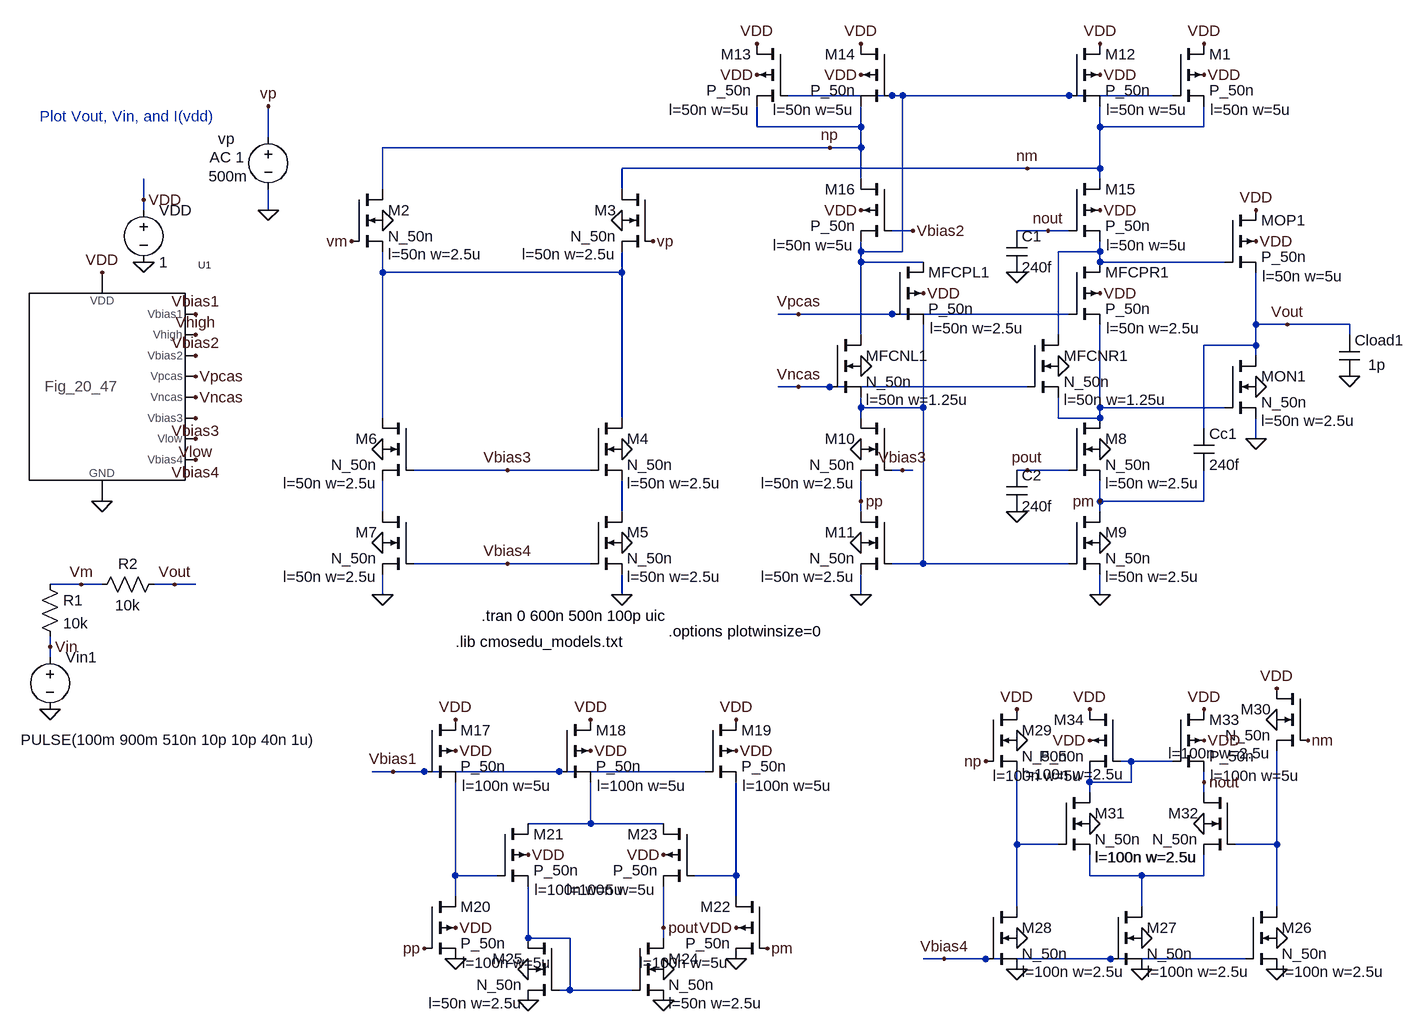
[diagram p0: schematic Fig24_53_tran.asc]
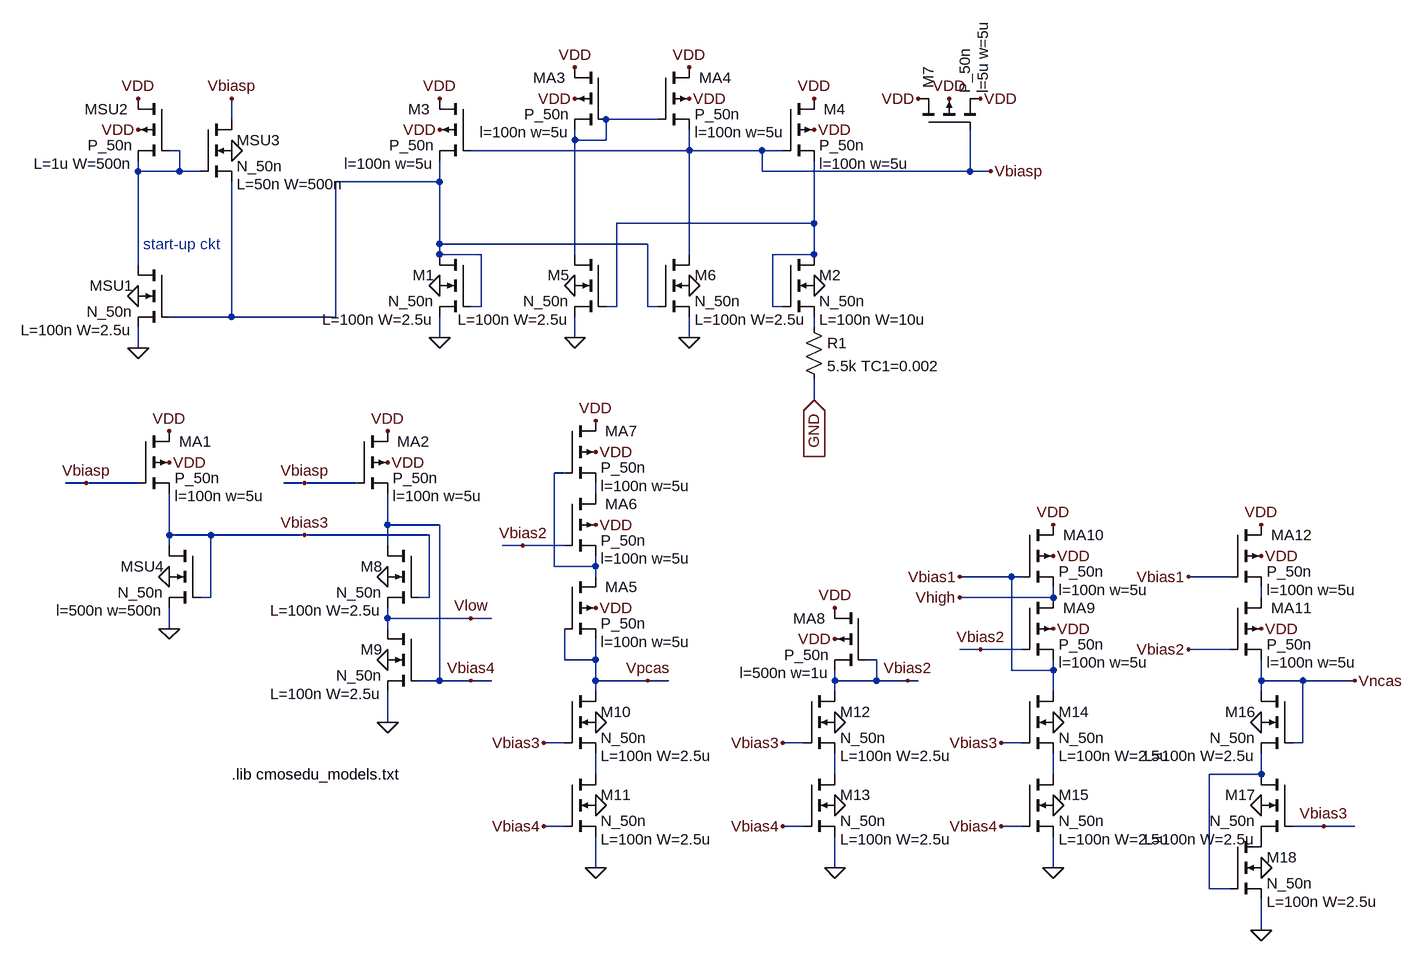
[diagram p1: sub-circuit fig_20_47.asc]
Fig24_53_tran.asc, the LTspice schematic file:
Version 4
SHEET 1 3376 680
WIRE 2512 -1136 2352 -1136
WIRE 2528 -1136 2512 -1136
WIRE 2784 -1136 2528 -1136
WIRE 2944 -1136 2784 -1136
WIRE 2304 -1088 2304 -1120
WIRE 2464 -1088 2464 -1120
WIRE 2464 -1088 2304 -1088
WIRE 2832 -1088 2832 -1120
WIRE 2992 -1088 2992 -1120
WIRE 2992 -1088 2832 -1088
WIRE 1552 -1072 1552 -1120
WIRE 2416 -1056 1728 -1056
WIRE 2464 -1056 2464 -1088
WIRE 2464 -1056 2416 -1056
WIRE 2720 -1024 2096 -1024
WIRE 2832 -1024 2832 -1088
WIRE 2832 -1024 2720 -1024
WIRE 2464 -1008 2464 -1056
WIRE 2832 -1008 2832 -1024
WIRE 1728 -992 1728 -1056
WIRE 2096 -992 2096 -1024
WIRE 1360 -976 1360 -1008
WIRE 1360 -960 1360 -976
WIRE 1552 -960 1552 -992
WIRE 2544 -928 2512 -928
WIRE 2752 -928 2704 -928
WIRE 2784 -928 2752 -928
WIRE 2464 -896 2464 -912
WIRE 2528 -896 2528 -1136
WIRE 2528 -896 2464 -896
WIRE 2832 -896 2832 -912
WIRE 2832 -896 2768 -896
WIRE 2464 -880 2464 -896
WIRE 2560 -880 2464 -880
WIRE 2832 -880 2832 -896
WIRE 3024 -880 2832 -880
WIRE 1728 -864 1728 -896
WIRE 2096 -864 2096 -896
WIRE 2096 -864 1728 -864
WIRE 2368 -800 2336 -800
WIRE 2512 -800 2368 -800
WIRE 2784 -800 2512 -800
WIRE 3072 -784 3072 -864
WIRE 3120 -784 3072 -784
WIRE 3216 -784 3120 -784
WIRE 2464 -768 2464 -880
WIRE 2768 -768 2768 -896
WIRE 3216 -768 3216 -784
WIRE 3072 -752 3072 -784
WIRE 3072 -752 2992 -752
WIRE 3072 -736 3072 -752
WIRE 2368 -688 2336 -688
WIRE 2416 -688 2368 -688
WIRE 2720 -688 2416 -688
WIRE 2464 -656 2464 -672
WIRE 2560 -656 2560 -784
WIRE 2560 -656 2464 -656
WIRE 2832 -656 2832 -784
WIRE 3024 -656 2832 -656
WIRE 1728 -640 1728 -864
WIRE 2096 -640 2096 -864
WIRE 2464 -640 2464 -656
WIRE 2768 -640 2768 -672
WIRE 2832 -640 2832 -656
WIRE 2832 -640 2768 -640
WIRE 2992 -624 2992 -752
WIRE 3072 -608 3072 -640
WIRE 1920 -560 1776 -560
WIRE 2048 -560 1920 -560
WIRE 2528 -560 2512 -560
WIRE 2544 -560 2528 -560
WIRE 2720 -560 2704 -560
WIRE 2784 -560 2720 -560
WIRE 2464 -512 2464 -544
WIRE 2832 -512 2832 -544
WIRE 2992 -512 2992 -560
WIRE 2992 -512 2832 -512
WIRE 1728 -496 1728 -544
WIRE 2096 -496 2096 -544
WIRE 2464 -496 2464 -512
WIRE 2832 -496 2832 -512
WIRE 1920 -416 1776 -416
WIRE 2048 -416 1920 -416
WIRE 2560 -416 2560 -656
WIRE 2560 -416 2512 -416
WIRE 2784 -416 2560 -416
WIRE 1264 -384 1216 -384
WIRE 1296 -384 1264 -384
WIRE 1408 -384 1376 -384
WIRE 1440 -384 1408 -384
WIRE 1728 -368 1728 -400
WIRE 2096 -368 2096 -400
WIRE 2464 -368 2464 -400
WIRE 2832 -368 2832 -400
WIRE 1216 -288 1216 -304
WIRE 1216 -272 1216 -288
WIRE 2880 -112 2864 -112
WIRE 2944 -112 2880 -112
WIRE 1744 -96 1712 -96
WIRE 1792 -96 1744 -96
WIRE 2000 -96 1792 -96
WIRE 2224 -96 2000 -96
WIRE 2816 -80 2816 -96
WIRE 2880 -80 2880 -112
WIRE 2880 -80 2816 -80
WIRE 2992 -80 2992 -96
WIRE 2816 -64 2816 -80
WIRE 2992 -64 2992 -80
WIRE 2048 -16 2048 -80
WIRE 2048 -16 1952 -16
WIRE 2160 -16 2048 -16
WIRE 2704 16 2704 -96
WIRE 2768 16 2704 16
WIRE 3104 16 3104 -128
WIRE 3104 16 3040 16
WIRE 1840 64 1840 -80
WIRE 1904 64 1840 64
WIRE 2272 64 2272 -80
WIRE 2272 64 2208 64
WIRE 2816 64 2816 32
WIRE 2896 64 2816 64
WIRE 2992 64 2992 32
WIRE 2992 64 2896 64
WIRE 1840 96 1840 64
WIRE 2272 96 2272 64
WIRE 2704 112 2704 16
WIRE 2896 112 2896 64
WIRE 3104 112 3104 16
WIRE 2160 144 2160 80
WIRE 1952 160 1952 80
WIRE 2016 160 1952 160
WIRE 2160 160 2160 144
WIRE 2592 192 2560 192
WIRE 2656 192 2592 192
WIRE 2848 192 2656 192
WIRE 3056 192 2848 192
WIRE 2016 240 2016 160
WIRE 2016 240 2000 240
WIRE 2112 240 2016 240
FLAG 1360 -880 0
FLAG 1360 -976 VDD
FLAG 1296 -864 VDD
FLAG 1296 -512 0
FLAG 1440 -800 Vbias1
FLAG 1440 -768 Vhigh
FLAG 1440 -736 Vbias2
FLAG 1440 -640 Vbias3
FLAG 1440 -704 Vpcas
FLAG 1440 -672 Vncas
FLAG 1440 -576 Vbias4
FLAG 1440 -608 Vlow
FLAG 1552 -960 0
FLAG 1552 -1120 vp
FLAG 1216 -192 0
FLAG 1408 -384 Vout
FLAG 1264 -384 Vm
FLAG 1216 -288 Vin
FLAG 1840 -128 VDD
FLAG 1840 -176 VDD
FLAG 2048 -128 VDD
FLAG 2048 -176 VDD
FLAG 2272 -128 VDD
FLAG 2272 -176 VDD
FLAG 1744 -96 Vbias1
FLAG 1840 144 VDD
FLAG 1952 32 VDD
FLAG 2272 144 VDD
FLAG 2160 32 VDD
FLAG 2160 208 0
FLAG 1952 208 0
FLAG 1952 256 0
FLAG 2160 256 0
FLAG 2272 192 0
FLAG 1840 192 0
FLAG 1792 176 pp
FLAG 2320 176 pm
FLAG 2160 144 pout
FLAG 3104 160 0
FLAG 3104 208 0
FLAG 2896 160 0
FLAG 2896 208 0
FLAG 2704 160 0
FLAG 2704 208 0
FLAG 2592 192 Vbias4
FLAG 2704 -144 0
FLAG 3104 -176 0
FLAG 2704 -192 VDD
FLAG 3104 -224 VDD
FLAG 2656 -112 np
FLAG 3152 -144 nm
FLAG 2816 -16 0
FLAG 2992 -16 0
FLAG 2992 -144 VDD
FLAG 2992 -192 VDD
FLAG 2816 -144 VDD
FLAG 2816 -192 VDD
FLAG 2992 -80 nout
FLAG 2992 -1168 VDD
FLAG 1728 -944 0
FLAG 2096 -944 0
FLAG 1680 -912 vm
FLAG 2144 -912 vp
FLAG 2096 -592 0
FLAG 2096 -448 0
FLAG 2096 -368 0
FLAG 1728 -592 0
FLAG 1728 -448 0
FLAG 1728 -368 0
FLAG 1920 -560 Vbias3
FLAG 1920 -416 Vbias4
FLAG 2832 -592 0
FLAG 2832 -448 0
FLAG 2832 -368 0
FLAG 2464 -592 0
FLAG 2464 -448 0
FLAG 2464 -368 0
FLAG 2528 -560 Vbias3
FLAG 2832 -1168 VDD
FLAG 2832 -1216 VDD
FLAG 2992 -1216 VDD
FLAG 2304 -1168 VDD
FLAG 2464 -1168 VDD
FLAG 2464 -1216 VDD
FLAG 2304 -1216 VDD
FLAG 2832 -960 VDD
FLAG 2464 -960 VDD
FLAG 2544 -928 Vbias2
FLAG 3216 -704 0
FLAG 3120 -784 Vout
FLAG 2560 -832 VDD
FLAG 2832 -832 VDD
FLAG 2768 -720 0
FLAG 2464 -720 0
FLAG 2368 -800 Vpcas
FLAG 2368 -688 Vncas
FLAG 3072 -912 VDD
FLAG 3072 -960 VDD
FLAG 3072 -688 0
FLAG 3072 -608 0
FLAG 2752 -928 nout
FLAG 2720 -1024 nm
FLAG 2416 -1056 np
FLAG 2720 -560 pout
FLAG 2832 -512 pm
FLAG 2464 -512 pp
FLAG 2704 -864 0
FLAG 2704 -496 0
SYMBOL voltage 1360 -976 R0
WINDOW 123 0 0 Left 0
WINDOW 39 0 0 Left 0
SYMATTR InstName VDD
SYMATTR Value 1
SYMBOL Fig_20_47 1296 -688 R0
SYMATTR InstName U1
SYMBOL voltage 1552 -1088 R0
WINDOW 0 -77 18 Left 0
WINDOW 3 -92 76 Left 0
WINDOW 123 -90 47 Left 0
WINDOW 39 0 0 Left 0
SYMATTR InstName vp
SYMATTR Value 500m
SYMATTR Value2 AC 1
SYMBOL voltage 1216 -288 R0
WINDOW 3 -45 143 Left 0
WINDOW 123 0 0 Left 0
WINDOW 39 0 0 Left 0
SYMATTR Value PULSE(100m 900m 510n 10p 10p 40n 1u)
SYMATTR InstName Vin1
SYMBOL res 1200 -400 R0
SYMATTR InstName R1
SYMATTR Value 10k
SYMBOL res 1280 -368 R270
WINDOW 0 32 56 VTop 0
WINDOW 3 0 56 VBottom 0
SYMATTR InstName R2
SYMATTR Value 10k
SYMBOL pmos4 1792 -176 R0
WINDOW 123 58 102 Left 0
WINDOW 0 56 16 Left 0
SYMATTR Value2 l=100n w=5u
SYMATTR InstName M17
SYMATTR Value P_50n
SYMBOL pmos4 2000 -176 R0
WINDOW 123 58 102 Left 0
WINDOW 0 56 16 Left 0
SYMATTR Value2 l=100n w=5u
SYMATTR InstName M18
SYMATTR Value P_50n
SYMBOL pmos4 2224 -176 R0
WINDOW 123 58 102 Left 0
WINDOW 0 56 16 Left 0
SYMATTR Value2 l=100n w=5u
SYMATTR InstName M19
SYMATTR Value P_50n
SYMBOL pmos4 1792 96 R0
WINDOW 123 58 102 Left 0
WINDOW 0 56 16 Left 0
SYMATTR Value2 l=100n w=5u
SYMATTR InstName M20
SYMATTR Value P_50n
SYMBOL pmos4 1904 -16 R0
WINDOW 123 58 102 Left 0
WINDOW 0 56 16 Left 0
SYMATTR Value2 l=100n w=5u
SYMATTR InstName M21
SYMATTR Value P_50n
SYMBOL pmos4 2320 96 M0
WINDOW 123 58 102 Left 0
WINDOW 0 56 16 Left 0
SYMATTR Value2 l=100n w=5u
SYMATTR InstName M22
SYMATTR Value P_50n
SYMBOL pmos4 2208 -16 M0
WINDOW 123 58 102 Left 0
WINDOW 0 56 16 Left 0
SYMATTR Value2 l=100n w=5u
SYMATTR InstName M23
SYMATTR Value P_50n
SYMBOL nmos4 2112 160 R0
WINDOW 123 56 100 Left 0
SYMATTR Value2 l=50n w=2.5u
SYMATTR InstName M24
SYMATTR Value N_50n
SYMBOL nmos4 2000 160 M0
WINDOW 123 56 100 Left 0
SYMATTR Value2 l=50n w=2.5u
SYMATTR InstName M25
SYMATTR Value N_50n
SYMBOL nmos4 3056 112 R0
WINDOW 123 56 100 Left 0
SYMATTR Value2 l=100n w=2.5u
SYMATTR InstName M26
SYMATTR Value N_50n
SYMBOL nmos4 2848 112 R0
WINDOW 123 56 100 Left 0
SYMATTR Value2 l=100n w=2.5u
SYMATTR InstName M27
SYMATTR Value N_50n
SYMBOL nmos4 2656 112 R0
WINDOW 123 56 100 Left 0
SYMATTR Value2 l=100n w=2.5u
SYMATTR InstName M28
SYMATTR Value N_50n
SYMBOL nmos4 2656 -192 R0
WINDOW 123 56 100 Left 0
SYMATTR Value2 l=100n w=2.5u
SYMATTR InstName M29
SYMATTR Value N_50n
SYMBOL nmos4 3152 -224 M0
WINDOW 123 56 100 Left 0
SYMATTR Value2 l=100n w=2.5u
SYMATTR InstName M30
SYMATTR Value N_50n
SYMBOL nmos4 2768 -64 R0
WINDOW 123 56 100 Left 0
SYMATTR Value2 l=100n w=2.5u
SYMATTR InstName M31
SYMATTR Value N_50n
SYMBOL nmos4 3040 -64 M0
WINDOW 123 56 100 Left 0
SYMATTR Value2 l=100n w=2.5u
SYMATTR InstName M32
SYMATTR Value N_50n
SYMBOL pmos4 2944 -192 R0
WINDOW 123 58 102 Left 0
WINDOW 0 56 16 Left 0
SYMATTR Value2 l=100n w=5u
SYMATTR InstName M33
SYMATTR Value P_50n
SYMBOL pmos4 2864 -192 M0
WINDOW 123 58 102 Left 0
WINDOW 0 56 16 Left 0
SYMATTR Value2 l=100n w=5u
SYMATTR InstName M34
SYMATTR Value P_50n
SYMBOL pmos4 2944 -1216 R0
WINDOW 123 58 102 Left 0
WINDOW 0 56 16 Left 0
SYMATTR Value2 l=50n w=5u
SYMATTR InstName M1
SYMATTR Value P_50n
SYMBOL nmos4 1680 -992 R0
WINDOW 123 56 100 Left 0
SYMATTR Value2 l=50n w=2.5u
SYMATTR InstName M2
SYMATTR Value N_50n
SYMBOL nmos4 2144 -992 M0
WINDOW 123 56 100 Left 0
SYMATTR Value2 l=50n w=2.5u
SYMATTR InstName M3
SYMATTR Value N_50n
SYMBOL nmos4 2048 -640 R0
WINDOW 123 56 100 Left 0
SYMATTR Value2 l=50n w=2.5u
SYMATTR InstName M4
SYMATTR Value N_50n
SYMBOL nmos4 2048 -496 R0
WINDOW 123 56 100 Left 0
SYMATTR Value2 l=50n w=2.5u
SYMATTR InstName M5
SYMATTR Value N_50n
SYMBOL nmos4 1776 -640 M0
WINDOW 123 56 100 Left 0
SYMATTR Value2 l=50n w=2.5u
SYMATTR InstName M6
SYMATTR Value N_50n
SYMBOL nmos4 1776 -496 M0
WINDOW 123 56 100 Left 0
SYMATTR Value2 l=50n w=2.5u
SYMATTR InstName M7
SYMATTR Value N_50n
SYMBOL nmos4 2784 -640 R0
WINDOW 123 56 100 Left 0
SYMATTR Value2 l=50n w=2.5u
SYMATTR InstName M8
SYMATTR Value N_50n
SYMBOL nmos4 2784 -496 R0
WINDOW 123 56 100 Left 0
SYMATTR Value2 l=50n w=2.5u
SYMATTR InstName M9
SYMATTR Value N_50n
SYMBOL nmos4 2512 -640 M0
WINDOW 123 56 100 Left 0
SYMATTR Value2 l=50n w=2.5u
SYMATTR InstName M10
SYMATTR Value N_50n
SYMBOL nmos4 2512 -496 M0
WINDOW 123 56 100 Left 0
SYMATTR Value2 l=50n w=2.5u
SYMATTR InstName M11
SYMATTR Value N_50n
SYMBOL pmos4 2784 -1216 R0
WINDOW 123 58 102 Left 0
WINDOW 0 56 16 Left 0
SYMATTR Value2 l=50n w=5u
SYMATTR InstName M12
SYMATTR Value P_50n
SYMBOL pmos4 2352 -1216 M0
WINDOW 123 58 102 Left 0
WINDOW 0 56 16 Left 0
SYMATTR Value2 l=50n w=5u
SYMATTR InstName M13
SYMATTR Value P_50n
SYMBOL pmos4 2512 -1216 M0
WINDOW 123 58 102 Left 0
WINDOW 0 56 16 Left 0
SYMATTR Value2 l=50n w=5u
SYMATTR InstName M14
SYMATTR Value P_50n
SYMBOL pmos4 2784 -1008 R0
WINDOW 123 58 102 Left 0
WINDOW 0 56 16 Left 0
SYMATTR Value2 l=50n w=5u
SYMATTR InstName M15
SYMATTR Value P_50n
SYMBOL pmos4 2512 -1008 M0
WINDOW 123 58 102 Left 0
WINDOW 0 56 16 Left 0
SYMATTR Value2 l=50n w=5u
SYMATTR InstName M16
SYMATTR Value P_50n
SYMBOL cap 3200 -768 R0
WINDOW 3 45 46 Left 0
SYMATTR Value 1p
SYMATTR InstName Cload1
SYMBOL pmos4 2512 -880 R0
WINDOW 123 58 102 Left 0
WINDOW 0 56 16 Left 0
SYMATTR Value2 l=50n w=2.5u
SYMATTR InstName MFCPL1
SYMATTR Value P_50n
SYMBOL pmos4 2784 -880 R0
WINDOW 123 58 102 Left 0
WINDOW 0 56 16 Left 0
SYMATTR Value2 l=50n w=2.5u
SYMATTR InstName MFCPR1
SYMATTR Value P_50n
SYMBOL nmos4 2720 -768 R0
WINDOW 123 56 100 Left 0
SYMATTR Value2 l=50n w=1.25u
SYMATTR InstName MFCNR1
SYMATTR Value N_50n
SYMBOL nmos4 2416 -768 R0
WINDOW 123 56 100 Left 0
SYMATTR Value2 l=50n w=1.25u
SYMATTR InstName MFCNL1
SYMATTR Value N_50n
SYMBOL pmos4 3024 -960 R0
WINDOW 123 58 102 Left 0
WINDOW 0 56 16 Left 0
SYMATTR Value2 l=50n w=5u
SYMATTR InstName MOP1
SYMATTR Value P_50n
SYMBOL nmos4 3024 -736 R0
WINDOW 123 56 100 Left 0
SYMATTR Value2 l=50n w=2.5u
SYMATTR InstName MON1
SYMATTR Value N_50n
SYMBOL cap 2976 -624 R0
SYMATTR InstName Cc1
SYMATTR Value 240f
SYMBOL cap 2688 -928 R0
SYMATTR InstName C1
SYMATTR Value 240f
SYMBOL cap 2688 -560 R0
SYMATTR InstName C2
SYMATTR Value 240f
TEXT 1840 -296 Left 0 !.lib cmosedu_models.txt
TEXT 1880 -336 Left 0 !.tran 0 600n 500n 100p uic
TEXT 1200 -1104 Left 0 ;Plot Vout, Vin, and I(vdd)
TEXT 2168 -312 Left 0 !.options plotwinsize=0

fig_20_47.asc, the sub-circuit schematic file:
Version 4
SHEET 1 2508 1124
WIRE 464 416 432 416
WIRE 544 -64 544 -80
WIRE 544 80 544 -64
WIRE 544 208 544 176
WIRE 544 416 464 416
WIRE 592 496 592 432
WIRE 592 512 592 496
WIRE 592 640 592 608
WIRE 608 -96 592 -96
WIRE 608 -64 544 -64
WIRE 608 -64 608 -96
WIRE 640 -64 608 -64
WIRE 656 496 592 496
WIRE 656 592 640 592
WIRE 656 592 656 496
WIRE 688 -144 688 -176
WIRE 688 160 592 160
WIRE 688 160 688 -48
WIRE 800 416 768 416
WIRE 800 496 656 496
WIRE 848 160 688 160
WIRE 848 160 848 -48
WIRE 880 416 800 416
WIRE 928 480 928 432
WIRE 928 512 928 480
WIRE 928 624 928 608
WIRE 928 640 928 624
WIRE 928 784 928 736
WIRE 992 496 800 496
WIRE 992 592 976 592
WIRE 992 592 992 496
WIRE 1008 -48 848 -48
WIRE 1008 -48 1008 -80
WIRE 1008 48 1008 -48
WIRE 1008 64 1008 48
WIRE 1008 192 1008 160
WIRE 1008 480 928 480
WIRE 1008 720 976 720
WIRE 1008 720 1008 480
WIRE 1056 624 928 624
WIRE 1056 720 1008 720
WIRE 1072 64 1008 64
WIRE 1072 144 1056 144
WIRE 1072 144 1072 64
WIRE 1088 624 1056 624
WIRE 1088 720 1056 720
WIRE 1136 512 1104 512
WIRE 1184 544 1184 400
WIRE 1200 400 1184 400
WIRE 1200 512 1136 512
WIRE 1200 688 1200 640
WIRE 1200 816 1168 816
WIRE 1200 944 1168 944
WIRE 1216 -112 1216 -128
WIRE 1216 64 1216 -112
WIRE 1216 192 1216 160
WIRE 1248 432 1248 416
WIRE 1248 544 1184 544
WIRE 1248 544 1248 528
WIRE 1248 560 1248 544
WIRE 1248 688 1200 688
WIRE 1248 688 1248 656
WIRE 1248 720 1248 688
WIRE 1248 736 1248 720
WIRE 1248 864 1248 832
WIRE 1248 1008 1248 960
WIRE 1264 -112 1216 -112
WIRE 1264 -112 1264 -144
WIRE 1280 144 1264 144
WIRE 1280 144 1280 16
WIRE 1328 48 1008 48
WIRE 1328 144 1328 48
WIRE 1328 720 1248 720
WIRE 1344 -144 1264 -144
WIRE 1344 144 1328 144
WIRE 1360 720 1328 720
WIRE 1392 -96 1056 -96
WIRE 1392 -96 1392 -128
WIRE 1392 64 1392 -96
WIRE 1392 192 1392 160
WIRE 1504 -96 1392 -96
WIRE 1504 -64 1504 -96
WIRE 1520 144 1520 64
WIRE 1536 -96 1504 -96
WIRE 1536 144 1520 144
WIRE 1568 816 1536 816
WIRE 1568 944 1536 944
WIRE 1584 16 1280 16
WIRE 1584 16 1584 -80
WIRE 1584 64 1520 64
WIRE 1584 64 1584 16
WIRE 1584 176 1584 160
WIRE 1584 288 1584 256
WIRE 1616 720 1616 704
WIRE 1616 736 1616 720
WIRE 1616 864 1616 832
WIRE 1616 1008 1616 960
WIRE 1680 688 1664 688
WIRE 1680 720 1616 720
WIRE 1680 720 1680 688
WIRE 1728 720 1680 720
WIRE 1744 720 1728 720
WIRE 1824 -64 1504 -64
WIRE 1824 -64 1824 -128
WIRE 1840 672 1808 672
WIRE 1856 -64 1824 -64
WIRE 1888 560 1808 560
WIRE 1888 704 1888 560
WIRE 1904 560 1888 560
WIRE 1904 672 1840 672
WIRE 1904 816 1872 816
WIRE 1904 944 1872 944
WIRE 1952 592 1808 592
WIRE 1952 592 1952 576
WIRE 1952 704 1888 704
WIRE 1952 704 1952 688
WIRE 1952 736 1952 704
WIRE 1952 864 1952 832
WIRE 1952 1008 1952 960
WIRE 2192 1040 2192 864
WIRE 2224 560 2160 560
WIRE 2224 672 2160 672
WIRE 2224 1040 2192 1040
WIRE 2272 592 2272 576
WIRE 2272 720 2272 688
WIRE 2272 736 2272 720
WIRE 2272 864 2192 864
WIRE 2272 864 2272 832
WIRE 2272 880 2272 864
WIRE 2272 1104 2272 1056
WIRE 2336 720 2272 720
WIRE 2336 816 2320 816
WIRE 2336 816 2336 720
WIRE 2368 944 2320 944
WIRE 2416 720 2336 720
WIRE 2416 944 2368 944
FLAG 544 -128 VDD
FLAG 544 -176 VDD
FLAG 544 208 0
FLAG 544 128 0
FLAG 688 -96 0
FLAG 688 -176 Vbiasp
FLAG 1008 -128 VDD
FLAG 1008 -176 VDD
FLAG 1584 -128 VDD
FLAG 1584 -176 VDD
FLAG 1856 -64 Vbiasp
FLAG 1008 192 0
FLAG 1008 112 0
FLAG 1584 112 0
FLAG 1392 -176 VDD
FLAG 1392 -224 VDD
FLAG 1216 -176 VDD
FLAG 1216 -224 VDD
FLAG 1216 112 0
FLAG 1392 112 0
FLAG 1216 192 0
FLAG 1392 192 0
FLAG 1792 -176 VDD
FLAG 1744 -176 VDD
FLAG 1840 -176 VDD
FLAG 592 384 VDD
FLAG 592 336 VDD
FLAG 464 416 Vbiasp
FLAG 928 384 VDD
FLAG 928 336 VDD
FLAG 800 416 Vbiasp
FLAG 592 640 0
FLAG 592 560 0
FLAG 928 560 0
FLAG 928 688 0
FLAG 928 784 0
FLAG 800 496 Vbias3
FLAG 1248 784 0
FLAG 1248 912 0
FLAG 1248 1008 0
FLAG 1056 624 Vlow
FLAG 1056 720 Vbias4
FLAG 1168 816 Vbias3
FLAG 1168 944 Vbias4
FLAG 1616 784 0
FLAG 1616 912 0
FLAG 1616 1008 0
FLAG 1536 816 Vbias3
FLAG 1536 944 Vbias4
FLAG 1952 784 0
FLAG 1952 912 0
FLAG 1952 1008 0
FLAG 1872 816 Vbias3
FLAG 1872 944 Vbias4
FLAG 1248 608 VDD
FLAG 1328 720 Vpcas
FLAG 1248 480 VDD
FLAG 1248 368 VDD
FLAG 1248 320 VDD
FLAG 1136 512 Vbias2
FLAG 1616 656 VDD
FLAG 1616 608 VDD
FLAG 1728 720 Vbias2
FLAG 1952 640 VDD
FLAG 1952 528 VDD
FLAG 1952 480 VDD
FLAG 1840 672 Vbias2
FLAG 1808 560 Vbias1
FLAG 1808 592 Vhigh
FLAG 2272 640 VDD
FLAG 2272 528 VDD
FLAG 2272 480 VDD
FLAG 2160 560 Vbias1
FLAG 2160 672 Vbias2
FLAG 2272 784 0
FLAG 2272 912 0
FLAG 2272 1008 0
FLAG 2272 1104 0
FLAG 2416 720 Vncas
FLAG 2368 944 Vbias3
FLAG 1584 288 GND
IOPIN 1584 288 In
SYMBOL pmos4 592 -176 M0
WINDOW 0 63 16 Left 0
WINDOW 123 56 100 Left 0
SYMATTR InstName MSU2
SYMATTR Value2 L=1u W=500n
SYMATTR Value P_50n
SYMBOL nmos4 592 80 M0
WINDOW 123 56 100 Left 0
SYMATTR Value2 L=100n W=2.5u
SYMATTR InstName MSU1
SYMATTR Value N_50n
SYMBOL nmos4 640 -144 R0
WINDOW 123 56 100 Left 0
SYMATTR Value2 L=50n W=500n
SYMATTR InstName MSU3
SYMATTR Value N_50n
SYMBOL pmos4 1056 -176 M0
WINDOW 0 63 16 Left 0
WINDOW 123 56 100 Left 0
SYMATTR InstName M3
SYMATTR Value2 l=100n w=5u
SYMATTR Value P_50n
SYMBOL pmos4 1536 -176 R0
WINDOW 0 63 16 Left 0
WINDOW 123 56 100 Left 0
SYMATTR InstName M4
SYMATTR Value2 l=100n w=5u
SYMATTR Value P_50n
SYMBOL nmos4 1056 64 M0
WINDOW 123 56 100 Left 0
SYMATTR Value2 L=100n W=2.5u
SYMATTR InstName M1
SYMATTR Value N_50n
SYMBOL nmos4 1536 64 R0
WINDOW 123 56 100 Left 0
SYMATTR Value2 L=100n W=10u
SYMATTR InstName M2
SYMATTR Value N_50n
SYMBOL res 1568 160 R0
SYMATTR InstName R1
SYMATTR Value 5.5k TC1=0.002
SYMBOL pmos4 1344 -224 R0
WINDOW 0 63 16 Left 0
WINDOW 123 56 100 Left 0
SYMATTR InstName MA4
SYMATTR Value2 l=100n w=5u
SYMATTR Value P_50n
SYMBOL pmos4 1264 -224 M0
WINDOW 0 63 16 Left 0
WINDOW 123 56 100 Left 0
SYMATTR InstName MA3
SYMATTR Value2 l=100n w=5u
SYMATTR Value P_50n
SYMBOL nmos4 1264 64 M0
WINDOW 123 56 100 Left 0
SYMATTR Value2 L=100n W=2.5u
SYMATTR InstName M5
SYMATTR Value N_50n
SYMBOL nmos4 1344 64 R0
WINDOW 123 56 100 Left 0
SYMATTR Value2 L=100n W=2.5u
SYMATTR InstName M6
SYMATTR Value N_50n
SYMBOL pmos4 1744 -128 R270
WINDOW 0 63 16 Left 0
WINDOW 123 56 100 Left 0
SYMATTR InstName M7
SYMATTR Value2 l=5u w=5u
SYMATTR Value P_50n
SYMBOL pmos4 544 336 R0
WINDOW 0 63 16 Left 0
WINDOW 123 56 100 Left 0
SYMATTR InstName MA1
SYMATTR Value2 l=100n w=5u
SYMATTR Value P_50n
SYMBOL pmos4 880 336 R0
WINDOW 0 63 16 Left 0
WINDOW 123 56 100 Left 0
SYMATTR InstName MA2
SYMATTR Value2 l=100n w=5u
SYMATTR Value P_50n
SYMBOL nmos4 640 512 M0
WINDOW 123 56 100 Left 0
SYMATTR Value2 l=500n w=500n
SYMATTR InstName MSU4
SYMATTR Value N_50n
SYMBOL nmos4 976 512 M0
WINDOW 123 56 100 Left 0
SYMATTR Value2 L=100n W=2.5u
SYMATTR InstName M8
SYMATTR Value N_50n
SYMBOL nmos4 976 640 M0
WINDOW 123 56 100 Left 0
SYMATTR Value2 L=100n W=2.5u
SYMATTR InstName M9
SYMATTR Value N_50n
SYMBOL nmos4 1200 736 R0
WINDOW 123 56 100 Left 0
SYMATTR Value2 L=100n W=2.5u
SYMATTR InstName M10
SYMATTR Value N_50n
SYMBOL nmos4 1200 864 R0
WINDOW 123 56 100 Left 0
SYMATTR Value2 L=100n W=2.5u
SYMATTR InstName M11
SYMATTR Value N_50n
SYMBOL nmos4 1568 736 R0
WINDOW 123 56 100 Left 0
SYMATTR Value2 L=100n W=2.5u
SYMATTR InstName M12
SYMATTR Value N_50n
SYMBOL nmos4 1568 864 R0
WINDOW 123 56 100 Left 0
SYMATTR Value2 L=100n W=2.5u
SYMATTR InstName M13
SYMATTR Value N_50n
SYMBOL nmos4 1904 736 R0
WINDOW 123 56 100 Left 0
SYMATTR Value2 L=100n W=2.5u
SYMATTR InstName M14
SYMATTR Value N_50n
SYMBOL nmos4 1904 864 R0
WINDOW 123 56 100 Left 0
SYMATTR Value2 L=100n W=2.5u
SYMATTR InstName M15
SYMATTR Value N_50n
SYMBOL pmos4 1200 560 R0
WINDOW 0 63 16 Left 0
WINDOW 123 56 100 Left 0
SYMATTR InstName MA5
SYMATTR Value2 l=100n w=5u
SYMATTR Value P_50n
SYMBOL pmos4 1200 432 R0
WINDOW 0 63 16 Left 0
WINDOW 123 56 100 Left 0
SYMATTR InstName MA6
SYMATTR Value2 l=100n w=5u
SYMATTR Value P_50n
SYMBOL pmos4 1200 320 R0
WINDOW 0 63 16 Left 0
WINDOW 123 56 100 Left 0
SYMATTR InstName MA7
SYMATTR Value2 l=100n w=5u
SYMATTR Value P_50n
SYMBOL pmos4 1664 608 M0
WINDOW 0 63 16 Left 0
WINDOW 123 56 100 Left 0
SYMATTR InstName MA8
SYMATTR Value2 l=500n w=1u
SYMATTR Value P_50n
SYMBOL pmos4 1904 592 R0
WINDOW 0 63 16 Left 0
WINDOW 123 56 100 Left 0
SYMATTR InstName MA9
SYMATTR Value2 l=100n w=5u
SYMATTR Value P_50n
SYMBOL pmos4 1904 480 R0
WINDOW 0 63 16 Left 0
WINDOW 123 56 100 Left 0
SYMATTR InstName MA10
SYMATTR Value2 l=100n w=5u
SYMATTR Value P_50n
SYMBOL pmos4 2224 592 R0
WINDOW 0 63 16 Left 0
WINDOW 123 56 100 Left 0
SYMATTR InstName MA11
SYMATTR Value2 l=100n w=5u
SYMATTR Value P_50n
SYMBOL pmos4 2224 480 R0
WINDOW 0 63 16 Left 0
WINDOW 123 56 100 Left 0
SYMATTR InstName MA12
SYMATTR Value2 l=100n w=5u
SYMATTR Value P_50n
SYMBOL nmos4 2320 736 M0
WINDOW 123 56 100 Left 0
SYMATTR Value2 L=100n W=2.5u
SYMATTR InstName M16
SYMATTR Value N_50n
SYMBOL nmos4 2320 864 M0
WINDOW 123 56 100 Left 0
SYMATTR Value2 L=100n W=2.5u
SYMATTR InstName M17
SYMATTR Value N_50n
SYMBOL nmos4 2224 960 R0
WINDOW 123 56 100 Left 0
SYMATTR Value2 L=100n W=2.5u
SYMATTR InstName M18
SYMATTR Value N_50n
TEXT 552 48 Left 0 ;start-up ckt
TEXT 688 864 Left 0 !.lib cmosedu_models.txt

The netlist it stands for:
* Fig24_53_tran.asc
VDD VDD 0 1
XU1 Vbias1 Vhigh Vbias2 Vpcas Vncas Vbias3 Vlow Vbias4 VDD 0 fig_20_47
vp vp 0 500m AC 1
Vin1 Vin 0 PULSE(100m 900m 510n 10p 10p 40n 1u)
R1 Vm Vin 10k
R2 Vm Vout 10k
M17 VDD Vbias1 N012 VDD P_50n l=100n w=5u
M18 VDD Vbias1 N009 VDD P_50n l=100n w=5u
M19 VDD Vbias1 N013 VDD P_50n l=100n w=5u
M20 N012 pp 0 VDD P_50n l=100n w=5u
M21 N009 N012 N015 VDD P_50n l=100n w=5u
M22 N013 pm 0 VDD P_50n l=100n w=5u
M23 N009 N013 pout VDD P_50n l=100n w=5u
M24 pout N015 0 0 N_50n l=50n w=2.5u
M25 N015 N015 0 0 N_50n l=50n w=2.5u
M26 N011 Vbias4 0 0 N_50n l=100n w=2.5u
M27 N014 Vbias4 0 0 N_50n l=100n w=2.5u
M28 N010 Vbias4 0 0 N_50n l=100n w=2.5u
M29 VDD np N010 0 N_50n l=100n w=2.5u
M30 VDD nm N011 0 N_50n l=100n w=2.5u
M31 N008 N010 N014 0 N_50n l=100n w=2.5u
M32 nout N011 N014 0 N_50n l=100n w=2.5u
M33 VDD N008 nout VDD P_50n l=100n w=5u
M34 VDD N008 N008 VDD P_50n l=100n w=5u
M1 VDD N001 nm VDD P_50n l=50n w=5u
M2 np Vm N003 0 N_50n l=50n w=2.5u
M3 nm vp N003 0 N_50n l=50n w=2.5u
M4 N003 Vbias3 N007 0 N_50n l=50n w=2.5u
M5 N007 Vbias4 0 0 N_50n l=50n w=2.5u
M6 N003 Vbias3 N006 0 N_50n l=50n w=2.5u
M7 N006 Vbias4 0 0 N_50n l=50n w=2.5u
M8 N005 pout pm 0 N_50n l=50n w=2.5u
M9 pm N004 0 0 N_50n l=50n w=2.5u
M10 N004 Vbias3 pp 0 N_50n l=50n w=2.5u
M11 pp N004 0 0 N_50n l=50n w=2.5u
M12 VDD N001 nm VDD P_50n l=50n w=5u
M13 VDD N001 np VDD P_50n l=50n w=5u
M14 VDD N001 np VDD P_50n l=50n w=5u
M15 nm nout N002 VDD P_50n l=50n w=5u
M16 np Vbias2 N001 VDD P_50n l=50n w=5u
Cload1 Vout 0 1p
MFCPL1 N001 Vpcas N004 VDD P_50n l=50n w=2.5u
MFCPR1 N002 Vpcas N005 VDD P_50n l=50n w=2.5u
MFCNR1 N002 Vncas N005 0 N_50n l=50n w=1.25u
MFCNL1 N001 Vncas N004 0 N_50n l=50n w=1.25u
MOP1 VDD N002 Vout VDD P_50n l=50n w=5u
MON1 Vout N005 0 0 N_50n l=50n w=2.5u
Cc1 Vout pm 240f
C1 nout 0 240f
C2 pout 0 240f

* block symbol definitions
.subckt fig_20_47 Vbias1 Vhigh Vbias2 Vpcas Vncas Vbias3 Vlow Vbias4 VDD GND
MSU2 VDD N001 N001 VDD P_50n L=1u W=500n
MSU1 N001 N002 0 0 N_50n L=100n W=2.5u
MSU3 Vbiasp N001 N002 0 N_50n L=50n W=500n
M3 VDD Vbiasp N002 VDD P_50n l=100n w=5u
M4 VDD Vbiasp N007 VDD P_50n l=100n w=5u
M1 N002 N002 0 0 N_50n L=100n W=2.5u
M2 N007 N007 N008 0 N_50n L=100n W=10u
R1 N008 GND 5.5k TC1=0.002
MA4 VDD N004 Vbiasp VDD P_50n l=100n w=5u
MA3 VDD N004 N004 VDD P_50n l=100n w=5u
M5 N004 N007 0 0 N_50n L=100n W=2.5u
M6 Vbiasp N002 0 0 N_50n L=100n W=2.5u
M7 VDD Vbiasp VDD VDD P_50n l=5u w=5u
MA1 VDD Vbiasp Vbias3 VDD P_50n l=100n w=5u
MA2 VDD Vbiasp Vbias4 VDD P_50n l=100n w=5u
MSU4 Vbias3 Vbias3 0 0 N_50n l=500n w=500n
M8 Vbias4 Vbias3 Vlow 0 N_50n L=100n W=2.5u
M9 Vlow Vbias4 0 0 N_50n L=100n W=2.5u
M10 Vpcas Vbias3 N006 0 N_50n L=100n W=2.5u
M11 N006 Vbias4 0 0 N_50n L=100n W=2.5u
M12 Vbias2 Vbias3 N009 0 N_50n L=100n W=2.5u
M13 N009 Vbias4 0 0 N_50n L=100n W=2.5u
M14 Vbias1 Vbias3 N010 0 N_50n L=100n W=2.5u
M15 N010 Vbias4 0 0 N_50n L=100n W=2.5u
MA5 N003 Vpcas Vpcas VDD P_50n l=100n w=5u
MA6 N005 Vbias2 N003 VDD P_50n l=100n w=5u
MA7 VDD N003 N005 VDD P_50n l=100n w=5u
MA8 VDD Vbias2 Vbias2 VDD P_50n l=500n w=1u
MA9 Vhigh Vbias2 Vbias1 VDD P_50n l=100n w=5u
MA10 VDD Vbias1 Vhigh VDD P_50n l=100n w=5u
MA11 N012 Vbias2 Vncas VDD P_50n l=100n w=5u
MA12 VDD Vbias1 N012 VDD P_50n l=100n w=5u
M16 Vncas Vncas N011 0 N_50n L=100n W=2.5u
M17 N011 Vbias3 P001 0 N_50n L=100n W=2.5u
M18 P001 N011 0 0 N_50n L=100n W=2.5u
* start-up ckt
.lib cmosedu_models.txt
.ends fig_20_47

.model NMOS NMOS
.model PMOS PMOS
.lib standard.mos
.lib cmosedu_models.txt
.tran 0 600n 500n 100p uic
* Plot Vout, Vin, and I(vdd)
.options plotwinsize=0
.backanno
.end